# Altium schematic sheet Stepper_driver_group.SchDoc: STM32F446 CNC
size B; Author: AM; CompanyName: Expatria Technologies; DrawnBy: A.Marles; Engineer: AM; Organization: Expatria Technologies; DocumentNumber: 4; SheetNumber: 4; SheetTotal: 14
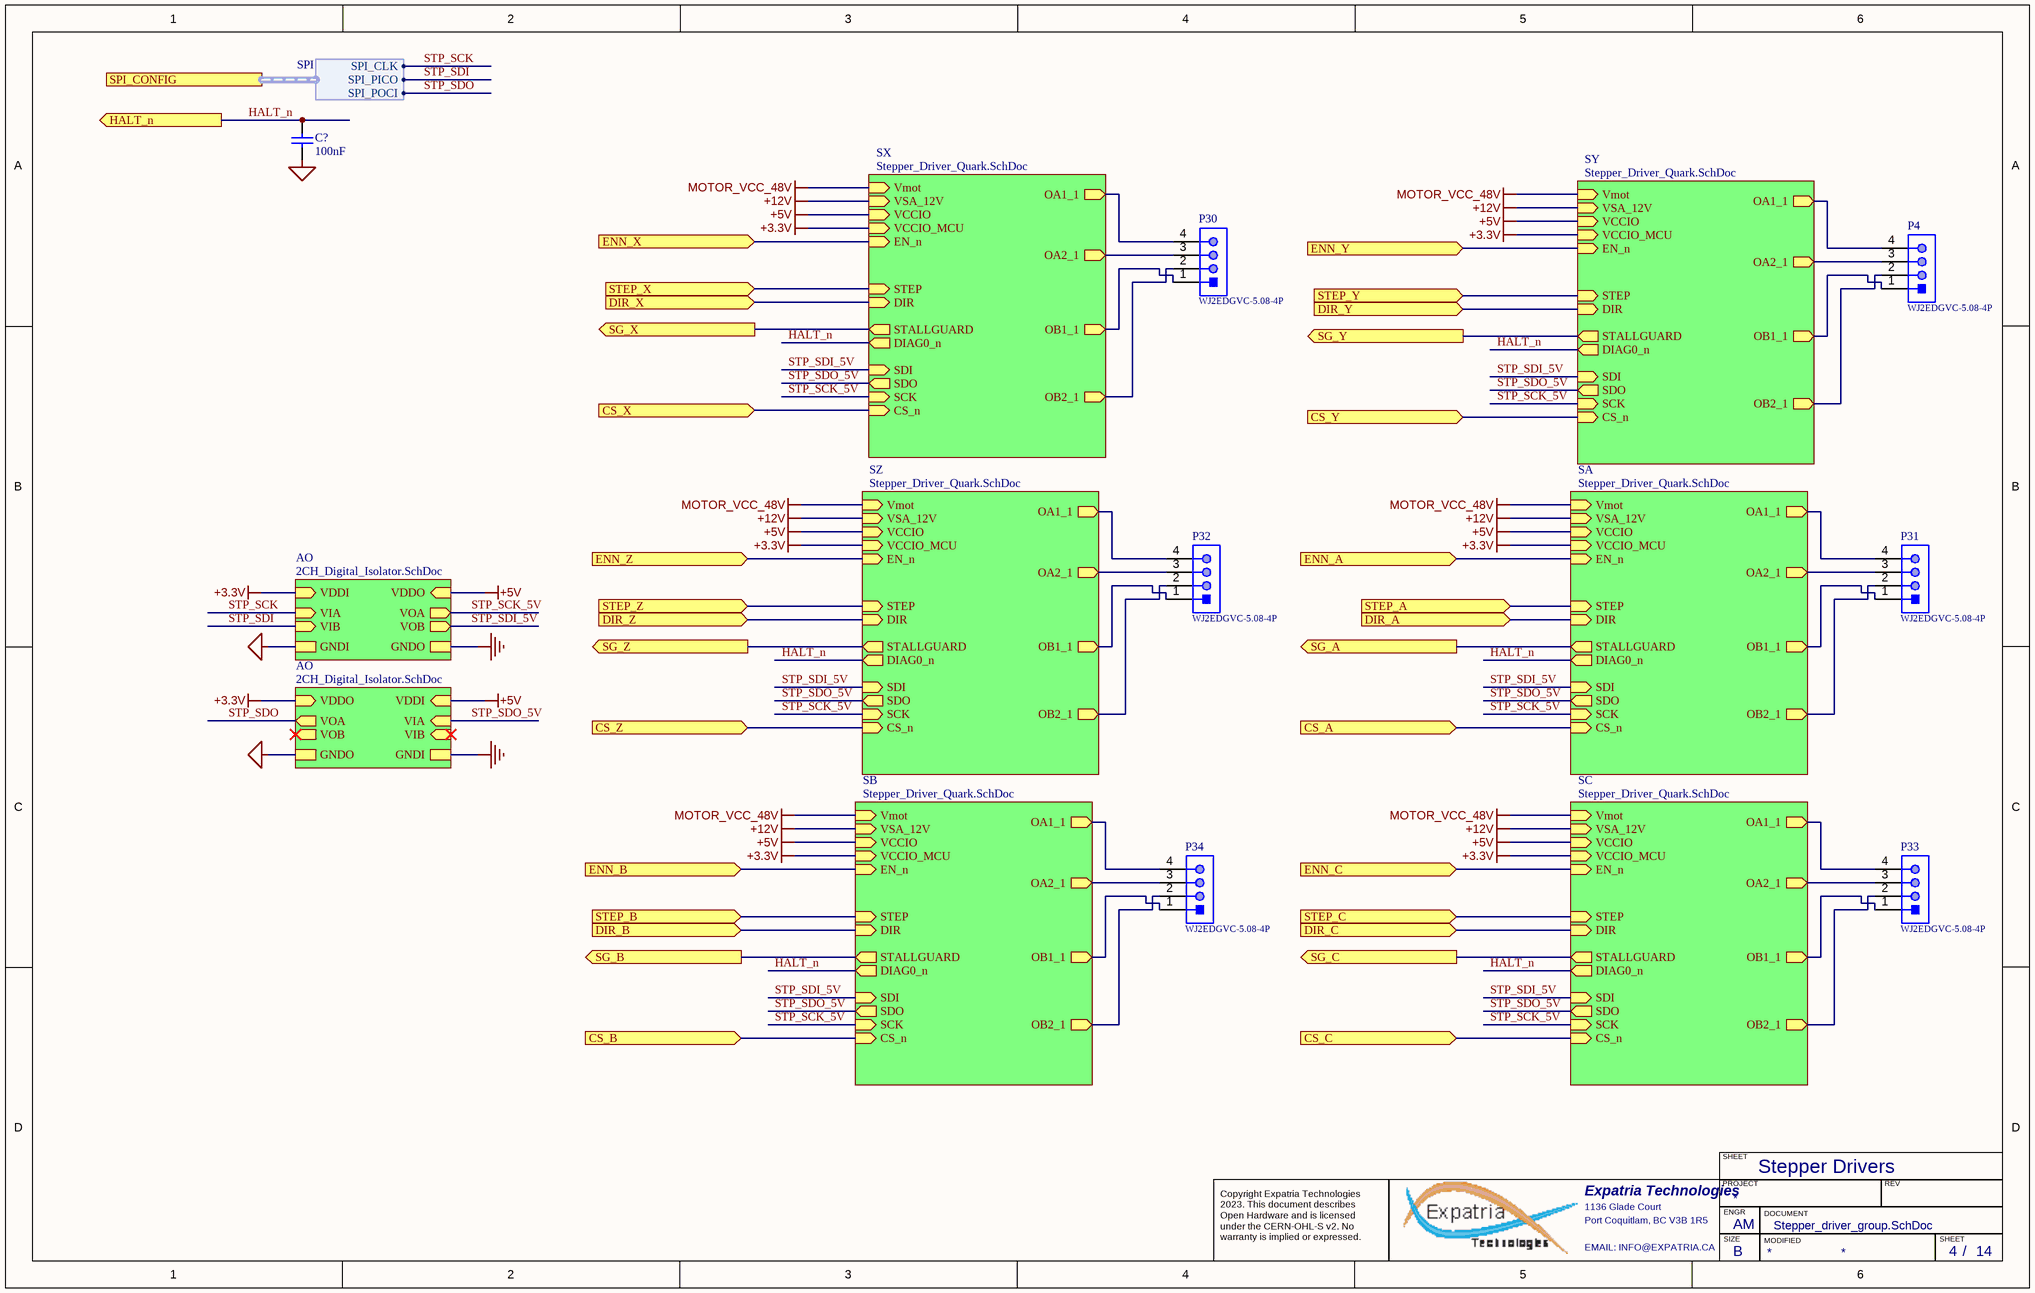
[diagram p0: Stepper_driver_group.SchDoc]

## Parts
C?  100nF  [0603_C]
P4  WJ2EDGVC-5.08-4P  [WJ2EDGVC-5.08-4P]
P30  WJ2EDGVC-5.08-4P  [WJ2EDGVC-5.08-4P]
P31  WJ2EDGVC-5.08-4P  [WJ2EDGVC-5.08-4P]
P32  WJ2EDGVC-5.08-4P  [WJ2EDGVC-5.08-4P]
P33  WJ2EDGVC-5.08-4P  [WJ2EDGVC-5.08-4P]
P34  WJ2EDGVC-5.08-4P  [WJ2EDGVC-5.08-4P]

## Sub-sheets
AO = 2CH_Digital_Isolator.SchDoc: VDDO (in), VIB (in), VIA (in), VOB (out), VOA (out), VDDI (in), GNDO, GNDI
AO = 2CH_Digital_Isolator.SchDoc: VDDO (in), VIB (in), VIA (in), VOB (out), VOA (out), VDDI (in), GNDO, GNDI
SA = Stepper_Driver_Quark.SchDoc: SCK (in), EN_n (in), OB1_1 (out), STEP (in), OB2_1 (out), DIR (in), STALLGUARD (out), SDI (in), SDO (out), OA1_1 (out), OA2_1 (out), CS_n (in), Vmot (in), VSA_12V (in), VCCIO (in), VCCIO_MCU (in), DIAG0_n (out)
SB = Stepper_Driver_Quark.SchDoc: SCK (in), EN_n (in), OB1_1 (out), STEP (in), OB2_1 (out), DIR (in), STALLGUARD (out), SDI (in), SDO (out), OA1_1 (out), OA2_1 (out), CS_n (in), Vmot (in), VSA_12V (in), VCCIO (in), VCCIO_MCU (in), DIAG0_n (out)
SC = Stepper_Driver_Quark.SchDoc: SCK (in), EN_n (in), OB1_1 (out), STEP (in), OB2_1 (out), DIR (in), STALLGUARD (out), SDI (in), SDO (out), OA1_1 (out), OA2_1 (out), CS_n (in), Vmot (in), VSA_12V (in), VCCIO (in), VCCIO_MCU (in), DIAG0_n (out)
SX = Stepper_Driver_Quark.SchDoc: SCK (in), EN_n (in), OB1_1 (out), STEP (in), OB2_1 (out), DIR (in), STALLGUARD (out), SDI (in), SDO (out), OA1_1 (out), OA2_1 (out), CS_n (in), Vmot (in), VSA_12V (in), VCCIO (in), VCCIO_MCU (in), DIAG0_n (out)
SY = Stepper_Driver_Quark.SchDoc: SCK (in), EN_n (in), OB1_1 (out), STEP (in), OB2_1 (out), DIR (in), STALLGUARD (out), SDI (in), OA1_1 (out), OA2_1 (out), CS_n (in), Vmot (in), VSA_12V (in), VCCIO (in), VCCIO_MCU (in), SDO (out), DIAG0_n (out)
SZ = Stepper_Driver_Quark.SchDoc: SCK (in), EN_n (in), OB1_1 (out), STEP (in), OB2_1 (out), DIR (in), STALLGUARD (out), SDI (in), SDO (out), OA1_1 (out), OA2_1 (out), CS_n (in), Vmot (in), VSA_12V (in), VCCIO (in), VCCIO_MCU (in), DIAG0_n (out)

## Ports
CS_A (in), CS_B (in), CS_C (in), CS_X (in), CS_Y (in), CS_Z (in), DIR_A (in), DIR_B (in), DIR_C (in), DIR_X (in), DIR_Y (in), DIR_Z (in), ENN_A (in), ENN_B (in), ENN_C (in), ENN_X (in), ENN_Y (in), ENN_Z (in), HALT_n (out), SG_A (out), SG_B (out), SG_C (out), SG_X (out), SG_Y (out), SG_Z (out), SPI_CONFIG (harness SPI), STEP_A (in), STEP_B (in), STEP_C (in), STEP_X (in), STEP_Y (in), STEP_Z (in)

## Harnesses
SPI: SPI_CLK, SPI_PICO, SPI_POCI

## Nets
+3.3V: sheet SX/VCCIO_MCU, sheet SY/VCCIO_MCU, sheet SZ/VCCIO_MCU, sheet SA/VCCIO_MCU, sheet SB/VCCIO_MCU, sheet SC/VCCIO_MCU, sheet AO/VDDI, sheet AO/VDDO
+5V: sheet SX/VCCIO, sheet SY/VCCIO, sheet SZ/VCCIO, sheet SA/VCCIO, sheet SB/VCCIO, sheet SC/VCCIO, sheet AO/VDDO, sheet AO/VDDI
+12V: sheet SX/VSA_12V, sheet SY/VSA_12V, sheet SZ/VSA_12V, sheet SA/VSA_12V, sheet SB/VSA_12V, sheet SC/VSA_12V
GND: sheet AO/GNDO, sheet AO/GNDI
MCU_GND: C?.2 ; sheet AO/GNDI, sheet AO/GNDO
MOTOR_VCC_48V: sheet SX/Vmot, sheet SY/Vmot, sheet SZ/Vmot, sheet SA/Vmot, sheet SB/Vmot, sheet SC/Vmot
CS_A: port CS_A, sheet SA/CS_n
CS_B: port CS_B, sheet SB/CS_n
CS_C: port CS_C, sheet SC/CS_n
CS_X: port CS_X, sheet SX/CS_n
CS_Y: port CS_Y, sheet SY/CS_n
CS_Z: port CS_Z, sheet SZ/CS_n
DIR_A: port DIR_A, sheet SA/DIR
DIR_B: port DIR_B, sheet SB/DIR
DIR_C: port DIR_C, sheet SC/DIR
DIR_X: port DIR_X, sheet SX/DIR
DIR_Y: port DIR_Y, sheet SY/DIR
DIR_Z: port DIR_Z, sheet SZ/DIR
ENN_A: port ENN_A, sheet SA/EN_n
ENN_B: port ENN_B, sheet SB/EN_n
ENN_C: port ENN_C, sheet SC/EN_n
ENN_X: port ENN_X, sheet SX/EN_n
ENN_Y: port ENN_Y, sheet SY/EN_n
ENN_Z: port ENN_Z, sheet SZ/EN_n
HALT_n: C?.1 ; port HALT_n, sheet SX/DIAG0_n, sheet SY/DIAG0_n, sheet SZ/DIAG0_n, sheet SA/DIAG0_n, sheet SB/DIAG0_n, sheet SC/DIAG0_n
SG_A: port SG_A, sheet SA/STALLGUARD
SG_B: port SG_B, sheet SB/STALLGUARD
SG_C: port SG_C, sheet SC/STALLGUARD
SG_X: port SG_X, sheet SX/STALLGUARD
SG_Y: port SG_Y, sheet SY/STALLGUARD
SG_Z: port SG_Z, sheet SZ/STALLGUARD
STEP_A: port STEP_A, sheet SA/STEP
STEP_B: port STEP_B, sheet SB/STEP
STEP_C: port STEP_C, sheet SC/STEP
STEP_X: port STEP_X, sheet SX/STEP
STEP_Y: port STEP_Y, sheet SY/STEP
STEP_Z: port STEP_Z, sheet SZ/STEP
STP_SCK: sheet AO/VIA, port SPI_CONFIG.SPI_CLK
STP_SCK_5V: sheet SX/SCK, sheet SY/SCK, sheet SZ/SCK, sheet SA/SCK, sheet SB/SCK, sheet SC/SCK, sheet AO/VOA
STP_SDI: sheet AO/VIB, port SPI_CONFIG.SPI_PICO
STP_SDI_5V: sheet SX/SDI, sheet SY/SDI, sheet SZ/SDI, sheet SA/SDI, sheet SB/SDI, sheet SC/SDI, sheet AO/VOB
STP_SDO: sheet AO/VOA, port SPI_CONFIG.SPI_POCI
STP_SDO_5V: sheet SX/SDO, sheet SY/SDO, sheet SZ/SDO, sheet SA/SDO, sheet SB/SDO, sheet SC/SDO, sheet AO/VIA
NetP4_1: P4.1 ; sheet SY/OB1_1
NetP4_2: P4.2 ; sheet SY/OB2_1
NetP4_3: P4.3 ; sheet SY/OA2_1
NetP4_4: P4.4 ; sheet SY/OA1_1
NetP30_1: P30.1 ; sheet SX/OB1_1
NetP30_2: P30.2 ; sheet SX/OB2_1
NetP30_3: P30.3 ; sheet SX/OA2_1
NetP30_4: P30.4 ; sheet SX/OA1_1
NetP31_1: P31.1 ; sheet SA/OB1_1
NetP31_2: P31.2 ; sheet SA/OB2_1
NetP31_3: P31.3 ; sheet SA/OA2_1
NetP31_4: P31.4 ; sheet SA/OA1_1
NetP32_1: P32.1 ; sheet SZ/OB1_1
NetP32_2: P32.2 ; sheet SZ/OB2_1
NetP32_3: P32.3 ; sheet SZ/OA2_1
NetP32_4: P32.4 ; sheet SZ/OA1_1
NetP33_1: P33.1 ; sheet SC/OB1_1
NetP33_2: P33.2 ; sheet SC/OB2_1
NetP33_3: P33.3 ; sheet SC/OA2_1
NetP33_4: P33.4 ; sheet SC/OA1_1
NetP34_1: P34.1 ; sheet SB/OB1_1
NetP34_2: P34.2 ; sheet SB/OB2_1
NetP34_3: P34.3 ; sheet SB/OA2_1
NetP34_4: P34.4 ; sheet SB/OA1_1

## Notes on the sheet
- Stepper Drivers
- SHEET
- Expatria Technologies
- 1136 Glade Court
- Port Coquitlam, BC V3B 1R5
- PROJECT
- SIZE
- ENGR
- MODIFIED
- DOCUMENT
- REV
- Copyright Expatria Technologies 2023. This document describes Open Hardware and is licensed under the CERN-OHL-S v2. No warranty is implied or expressed.
- EMAIL: INFO@EXPATRIA.CA
- B
- /

## Library data of the parts
C? = 0603 100nF (104) 10% 50V: Chip capacitors; Manufacturer: YAGEO; PartNumber: CC0603KRX7R9BB104; Tolerance: 10%; Voltage: 50V; ComponentLink1Description: Supplier link; ComponentLink1URL: http://www.szlcsc.com/product/details_15331.html; Package: 0603; Supplier: LC; SuppliersPartNumber: C14663; Capacitance: 100nF
P4 P30-P34 = WJ2EDGVC-5.08-4P: 4 Straight pin 1 5.08mm Green Board Edge/Receptacle-Close Straight,P=5.08mm Pluggable System Terminal Block ROHS; Manufacturer: Ningbo Kangnex Elec; Supplier Part Number 1: C8436; Manufacturer Part Number: WJ2EDGVC-5.08-4P; RoHS: Yes; Category: Terminals; SuppliersPartNumber: C8436; Supplier 1: LCSC